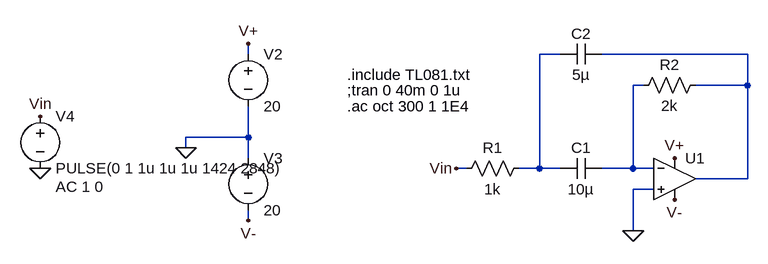
[diagram p0: schematic Parcial.asc]
Parcial.asc, the LTspice schematic file:
Version 4
SHEET 1 1160 680
WIRE -448 -32 -448 -48
WIRE 32 -32 0 -32
WIRE 320 -32 96 -32
WIRE 160 16 144 16
WIRE 320 16 320 -32
WIRE 320 16 240 16
WIRE -448 96 -448 48
WIRE -448 96 -544 96
WIRE -544 112 -544 96
WIRE -448 128 -448 96
WIRE -112 144 -128 144
WIRE 0 144 0 -32
WIRE 0 144 -32 144
WIRE 32 144 0 144
WIRE 144 144 144 16
WIRE 144 144 96 144
WIRE 176 144 144 144
WIRE 320 160 320 16
WIRE 320 160 240 160
WIRE 176 176 144 176
WIRE -448 224 -448 208
WIRE 144 240 144 176
FLAG 144 240 0
FLAG -544 112 0
FLAG -448 -48 V+
FLAG -448 224 V-
FLAG -128 144 Vin
FLAG -768 64 Vin
FLAG -768 144 0
FLAG 208 128 V+
FLAG 208 192 V-
SYMBOL voltage -448 -48 R0
WINDOW 123 0 0 Left 0
WINDOW 39 0 0 Left 0
SYMATTR InstName V2
SYMATTR Value 20
SYMBOL voltage -448 112 R0
WINDOW 123 0 0 Left 0
WINDOW 39 0 0 Left 0
SYMATTR InstName V3
SYMATTR Value 20
SYMBOL voltage -768 48 R0
WINDOW 123 24 124 Left 2
WINDOW 39 0 0 Left 0
SYMATTR Value2 AC 1 0
SYMATTR InstName V4
SYMATTR Value PULSE(0 1 1u 1u 1u 1424 2848)
SYMBOL cap 96 128 R90
WINDOW 0 0 32 VBottom 2
WINDOW 3 32 32 VTop 2
SYMATTR InstName C1
SYMATTR Value 10µ
SYMBOL cap 96 -48 R90
WINDOW 0 0 32 VBottom 2
WINDOW 3 32 32 VTop 2
SYMATTR InstName C2
SYMATTR Value 5µ
SYMBOL res 256 0 R90
WINDOW 0 0 56 VBottom 2
WINDOW 3 32 56 VTop 2
SYMATTR InstName R2
SYMATTR Value 2k
SYMBOL res -16 128 R90
WINDOW 0 0 56 VBottom 2
WINDOW 3 32 56 VTop 2
SYMATTR InstName R1
SYMATTR Value 1k
SYMBOL OpAmps\\UniversalOpamp2 208 160 R0
SYMATTR InstName U1
TEXT -296 48 Left 2 !.ac oct 300 1 1E4
TEXT -296 24 Left 2 !;tran 0 40m 0 1u
TEXT -296 0 Left 2 !.include TL081.txt

The netlist it stands for:
* Parcial.asc
V2 V+ 0 20
V3 0 V- 20
V4 Vin 0 PULSE(0 1 1u 1u 1u 1424 2848) AC 1 0
C1 N003 N001 10µ
C2 N002 N001 5µ
R2 N002 N003 2k
R1 N001 Vin 1k
XU1 0 N003 V+ V- N002 level.2 Avol=1Meg GBW=10Meg Slew=10Meg ilimit=25m rail=0 Vos=0 phimargin=45 en=0 enk=0 in=0 ink=0 Rin=500Meg  ; pins IN+ IN- V+ V- OUT
.ac oct 300 1 1E4
;tran 0 40m 0 1u
.include TL081.txt
.lib UniversalOpamps2.sub
.backanno
.end